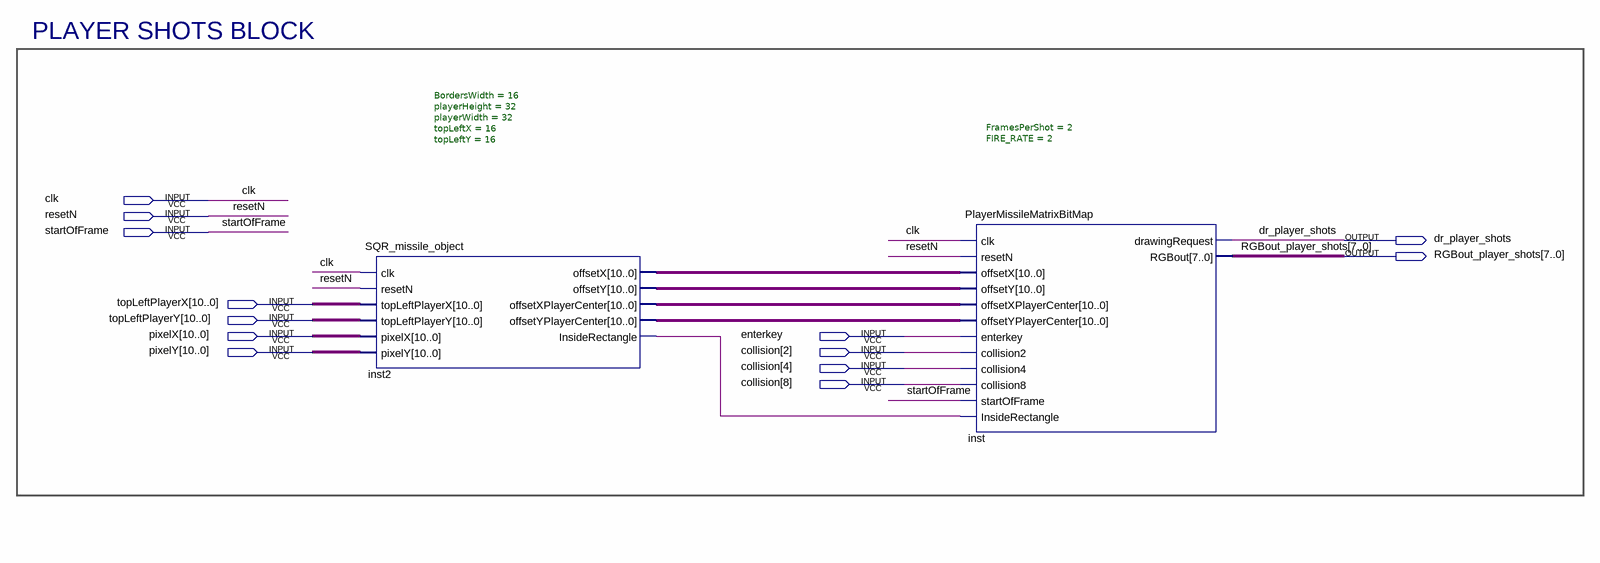
[diagram p0: schematic sheet]
// Quartus schematic PLAYER_SHOTS_DISPLAY.bdf as structural Verilog: 2 symbols, 13 pins
module PLAYER_SHOTS_DISPLAY (
  input  clk,
  input  resetN,
  input  startOfFrame,
  input  [10:0] topLeftPlayerX,
  input  [10:0] topLeftPlayerY,
  input  [10:0] pixelX,
  input  enterkey,
  input  [10:0] pixelY,
  input  [8:2] collision,
  output dr_player_shots,
  output [7:0] RGBout_player_shots
);

  wire inst2_insiderectangle;
  wire [10:0] inst2_offsetx, inst2_offsetxplayercenter, inst2_offsety, inst2_offsetyplayercenter;

  SQR_missile_object #(.BordersWidth(16), .playerHeight(32), .playerWidth(32), .topLeftX(16), .topLeftY(16)) inst2 (
    .clk(clk), .resetN(resetN), .topLeftPlayerX(topLeftPlayerX), .topLeftPlayerY(topLeftPlayerY),
    .pixelX(pixelX), .pixelY(pixelY), .offsetX(inst2_offsetx), .offsetY(inst2_offsety),
    .offsetXPlayerCenter(inst2_offsetxplayercenter), .offsetYPlayerCenter(inst2_offsetyplayercenter),
    .InsideRectangle(inst2_insiderectangle));
  PlayerMissileMatrixBitMap #(.FramesPerShot(2), .FIRE_RATE(2)) inst (
    .clk(clk), .resetN(resetN), .offsetX(inst2_offsetx), .offsetY(inst2_offsety),
    .offsetXPlayerCenter(inst2_offsetxplayercenter), .offsetYPlayerCenter(inst2_offsetyplayercenter),
    .enterkey(enterkey), .collision2(collision[2]), .collision4(collision[4]), .collision8(collision[8]),
    .startOfFrame(startOfFrame), .InsideRectangle(inst2_insiderectangle), .drawingRequest(dr_player_shots),
    .RGBout(RGBout_player_shots));

  // Notes on the sheet:
  //   PLAYER SHOTS BLOCK
endmodule
